# EAGLE design Xadow_SD (EAGLE 7.1.0)
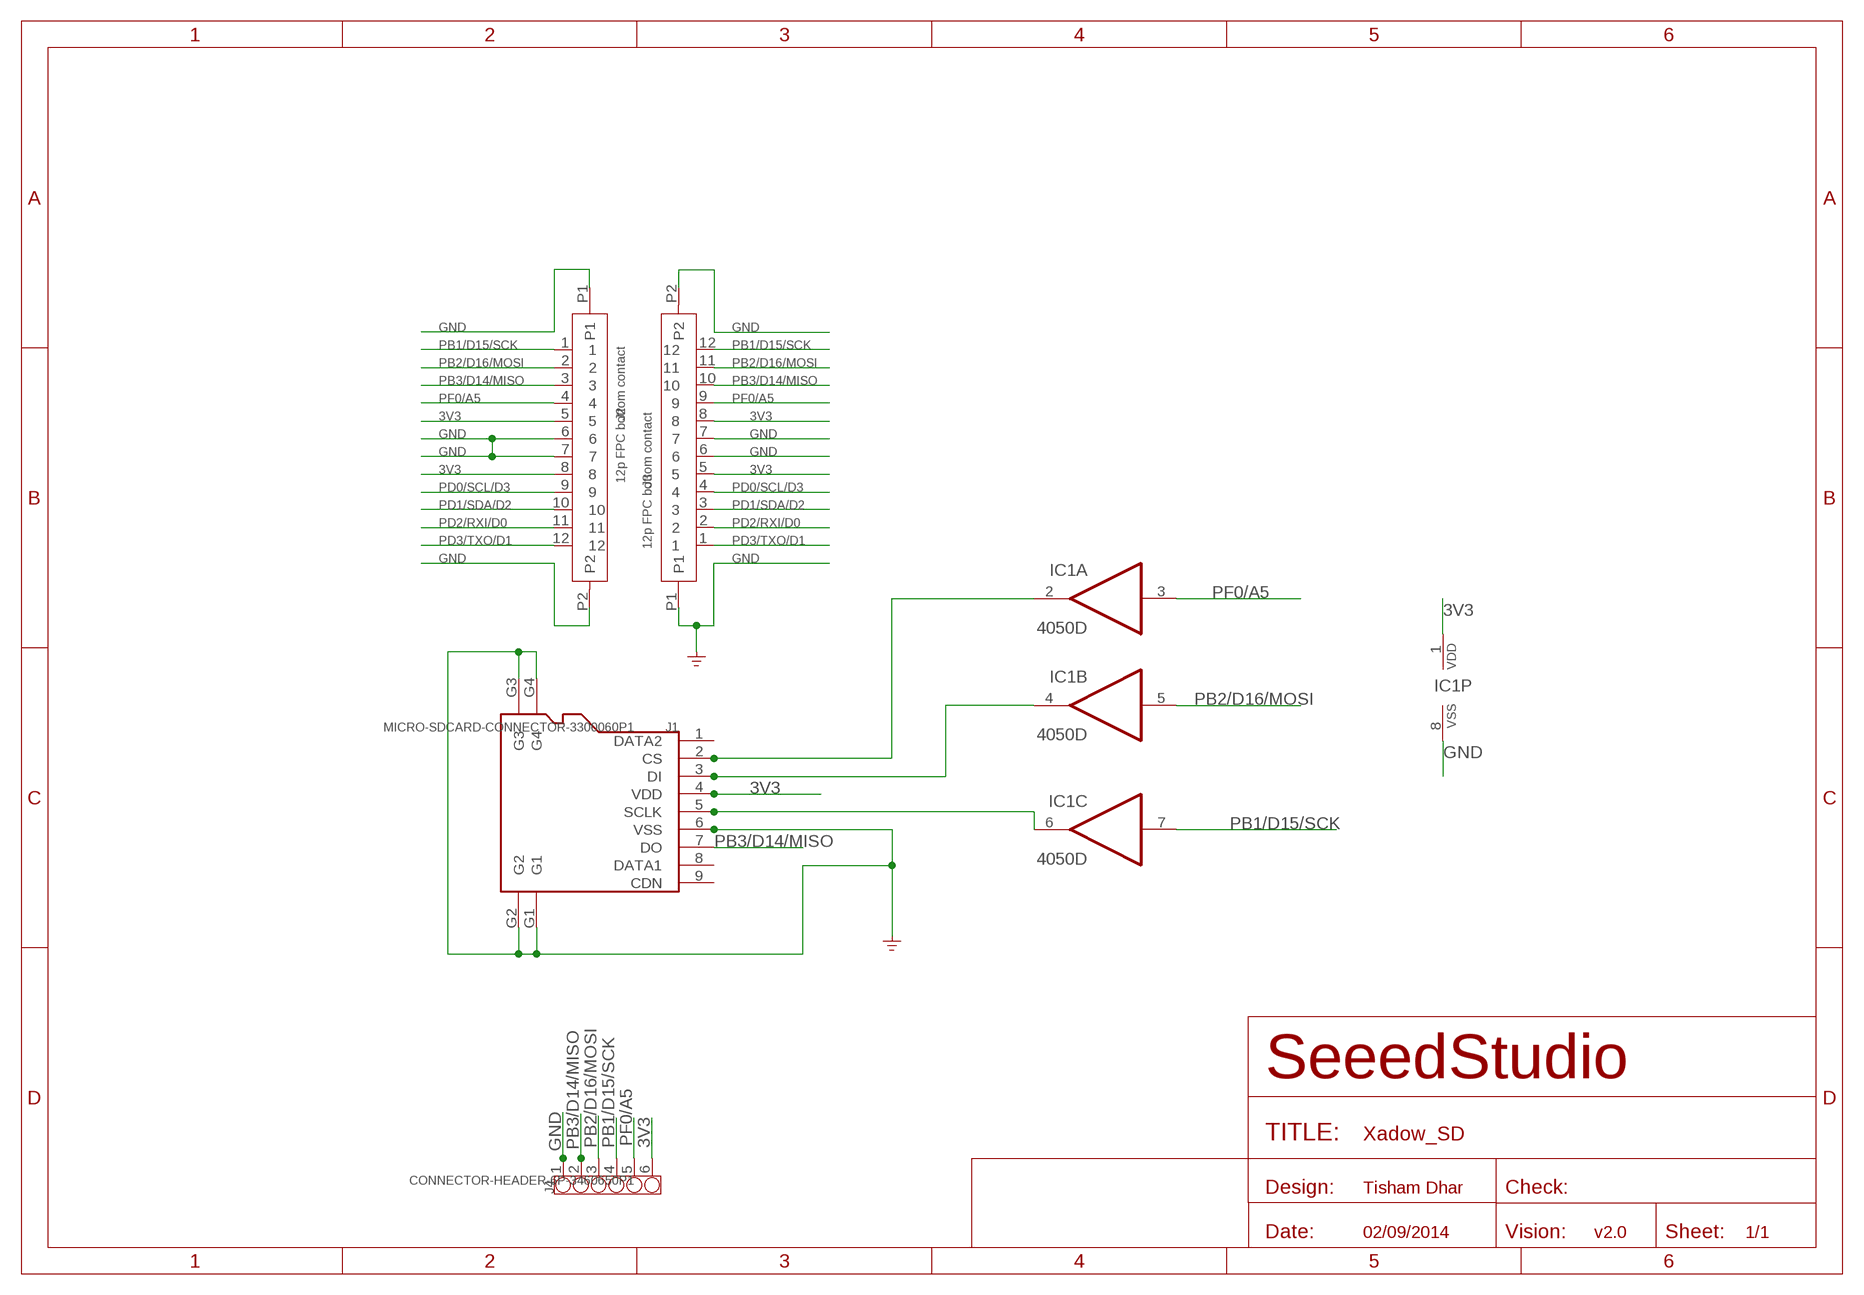
[diagram p0: schematic, sheet 1]

## Parts
IC1  4050D  [SO16]
J1  MICRO-SDCARD-CONNECTOR-3300060P1  [9P-SMD-W-RING]
J2  12p FPC bottom contact  FPC052002-12LT  [12P-0.5]
J3  12p FPC bottom contact  FPC052002-12LT  [12P-0.5]
J4  CONNECTOR-HEADER-6P-3460650P1  [1X6P-2.54-2.54-11.6-3.0-BLACK-MALE]

## Nets
3V3: IC1.1(P:VDD) J1.4(VDD) J2.5 J2.8 J3.5 J3.8 J4.6
CS: IC1.2(A:O) J1.2(CS)
GND: IC1.8(P:VSS) J1.6(VSS) J1.G1 J1.G2 J1.G3 J1.G4 J2.6 J2.7 J2.P1 J2.P2 J3.6 J3.7 J3.P1 J3.P2 J4.1
MOSI: IC1.4(B:O) J1.3(DI)
PB1/D15/SCK: IC1.7(C:I) J2.1 J3.12 J4.4
PB2/D16/MOSI: IC1.5(B:I) J2.2 J3.11 J4.3
PB3/D14/MISO: J1.7(DO) J2.3 J3.10 J4.2
PD0/SCL/D3: J2.9 J3.4
PD1/SDA/D2: J2.10 J3.3
PD2/RXI/D0: J2.11 J3.2
PD3/TXO/D1: J2.12 J3.1
PF0/A5: IC1.3(A:I) J2.4 J3.9 J4.5
SCK: IC1.6(C:O) J1.5(SCLK)
Unconnected: IC1.9(D:I) IC1.10(D:O) IC1.11(E:I) IC1.12(E:O) IC1.14(F:I) IC1.15(F:O) J1.1(DATA2) J1.8(DATA1) J1.9(CDN)

## Notes on the sheet
- Tisham Dhar
- 02/09/2014 | v2.0

## Library data of the parts
IC1 = 40xx:4050: Hex non-inverting BUFFER
J1 = OPL:MICRO-SDCARD-CONNECTOR: Micro SD Card
J2 J3 = template:FPC052002-12LT
J4 = OPL:CONNECTOR-HEADER-6P

## Net classes
0 default: width 0.152 mm, drill 0.305 mm, clearance 0.152 mm
1 GND: width 0.305 mm, drill 0.305 mm, clearance 0.152 mm to class 0, clearance 0.152 mm
3 usbvcc: width 0.203 mm, drill 0.305 mm, clearance 0.203 mm

## Board
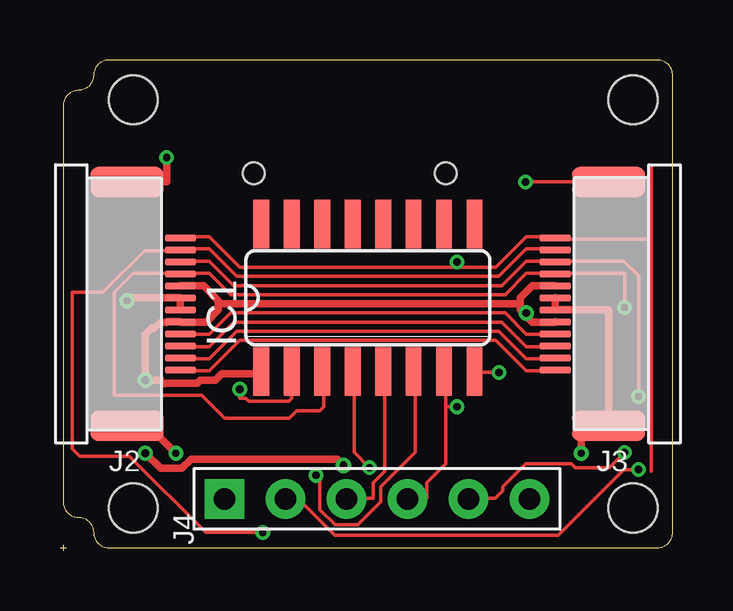
[diagram p1: board, top side]
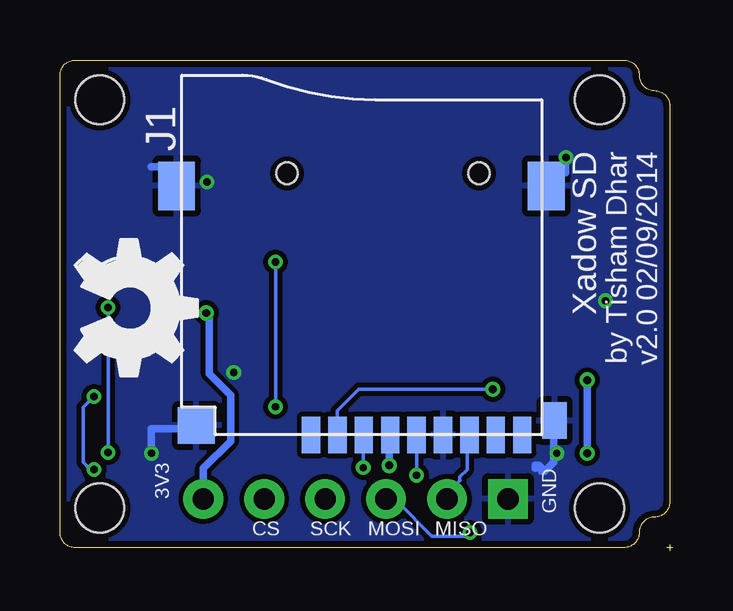
[diagram p2: board, bottom side, seen from below]

Size 25.53 x 20.45 mm. Coordinates in mm from the lower left corner, seen from the top.
Outline: 25.53,19.81 arc90 24.89,20.45
Outline: 2.03,20.45 arc90 1.4,19.81
Outline: 1.4,19.81 arc-90 0.76,19.18
Outline: 0.76,19.18 arc90 0.13,18.54
Outline: 0.13,2.03 arc90 0.76,1.4
Outline: 0.76,1.4 arc-90 1.4,0.76
Outline: 1.4,0.76 arc90 2.03,0.13
Outline: 24.89,0.13 arc90 25.53,0.76
Outline: 25.53,0.76 25.53,19.81
Outline: 25.53,19.81 arc90 24.89,20.45
Outline: 24.89,20.45 2.03,20.45
Outline: 2.03,20.45 arc90 1.4,19.81
Outline: 1.4,19.81 arc-90 0.76,19.18
Outline: 0.76,19.18 arc90 0.13,18.54
Outline: 0.13,18.54 0.13,2.03
Outline: 0.13,2.03 arc90 0.76,1.4
Outline: 0.76,1.4 arc-90 1.4,0.76
Outline: 1.4,0.76 1.4,0.76
Outline: 1.4,0.76 arc90 2.03,0.13
Outline: 2.03,0.13 24.89,0.13
Outline: 24.89,0.13 arc90 25.53,0.76
Outline: 0,0.13 0.25,0.13
Outline: 0.13,0.25 0.13,0
Copper layers (1*16): Top 0.035mm / dielectric 1.5mm / Bottom 0.035mm
Design rules "dirt_cheap_dirty_boards.v1": minimum track width 5mil, minimum drill 12mil, track to track 5mil, track to pad 5mil, pad to pad 5mil, via to via 5mil, smd to smd 0mil, copper to edge 10mil, drill to drill 10mil, minimum pad ring 10mil, minimum via ring 6mil, stop-mask expansion 2mil, vias tented up to drill 25mil, thermal gap 10mil
Holes 2.03 mm at 3.05,1.78 3.05,18.8 23.88,18.8 23.88,1.78
tRestrict: area 20.3,10 to 21,10.5; area 4.8,10 to 5.3,10.5

### Footprints (pad centres in the part's own frame; a part is rotated, then mirrored left to right if it is on the bottom)
SO16 = smd 0.66 x 2.032: 1 -4.445,-3.073; 2 -3.175,-3.073; 3 -1.905,-3.073; 4 -0.635,-3.073; 5 0.635,-3.073; 6 1.905,-3.073; 7 3.175,-3.073; 8 4.445,-3.073; 9 4.445,3.073; 10 3.175,3.073; 11 1.905,3.073; 12 0.635,3.073; 13 -0.635,3.073; 14 -1.905,3.073; 15 -3.175,3.073; 16 -4.445,3.073
9P-SMD-W-RING = smd 1.524 x 0.762: 1 -7.493,2.114; 2 -7.493,1.014; 3 -7.493,-0.086; 4 -7.493,-1.186; 5 -7.493,-2.286; 6 -7.493,-3.386; 7 -7.493,-4.486; 8 -7.493,-5.586; 9 -7.493,-6.686 | smd 1.524 x 1.016: G1 -6.893,-8.032 | smd 2.032 x 1.524: G2 2.88,-7.686; G3 2.88,7.714 | smd 1.524 x 1.524: G4 -7.101,6.895 | hole 0.889: 3.407,-4.886; 3.407,3.114
12P-0.5 = smd 0.3 x 1.3: 1 -2.75,2.35; 2 -2.25,2.35; 3 -1.75,2.35; 4 -1.25,2.35; 5 -0.75,2.35; 6 -0.25,2.35; 7 0.25,2.35; 8 0.75,2.35; 9 1.25,2.35; 10 1.75,2.35; 11 2.25,2.35; 12 2.75,2.35 | smd 1.27 x 3.048: P1 -5.08,0.127; P2 5.08,0.127
1X6P-2.54-2.54-11.6-3.0-BLACK-MALE = drill 0.889 pad 1.651 square: 1 0,6.35 | drill 0.889 pad 1.651: 2 0,3.81; 3 0,1.27; 4 0,-1.27; 5 0,-3.81; 6 0,-6.35

### Placement (x,y rotation side)
IC1  12.83,10.54 0 top
J1  12.95,12.32 90 bottom
J2  2.67,10.29 270 top
J3  22.99,10.29 90 top
J4  13.21,2.16 90 top
U$3  [OSHW_FILLX200_NOTEXT]  24.89,12.95 270 bottom

### Tracks (layer width: path | path; a pad name or v marks a point on that pad's centre or on a via)
3V3  (via drill 0.33)
  Top 0.203: 19.18,10.31 19.15,10.31 19.05,10.29 | 4.37,6.96 4.2,7.13 | 4.9,9.55 J2.8
  Top 0.305: J2.5 5.98,11.04 6.6,10.41 6.6,10.29 | J3.8 19.67,11.04 19.18,10.54 19.18,10.31 19.18,10.03 19.37,9.84 | 19.37,9.84 19.68,9.52 20.62,9.52 J3.5 | 6.6,10.29 6.6,10.03 6.1,9.52 5.03,9.52 J2.8 4.45,9.52 4.19,9.52 3.94,9.27 3.81,9.27 3.56,9.02 v3.56,7.11 4.19,7.11 4.2,7.13 | 6.6,10.29 19.05,10.29 | 4.37,6.96 4.45,6.99 5.71,6.99 5.84,7.11 6.48,7.11 6.73,7.37 8.38,7.37 IC1.1 | v11.81,3.56 11.56,3.81 5.46,3.81 5.08,3.43 4.19,3.43 v3.56,4.06 | 4.9,9.55 4.47,9.55 | v19.43,9.91 19.37,9.84
  Bottom 0.152: 11.46,5.51 11.76,5.51 J1.4
  Bottom 0.305: 11.76,5.44 11.76,4.83 J1.4 11.81,4.7 v11.81,3.56 | v3.56,7.11 v3.56,4.06 | v19.43,9.91 19.3,9.91 19.3,7.37 18.41,6.48 18.41,4.57 19.56,3.43 J4.6
CS  (via drill 0.33)
  Top 0.152: v7.49,6.73 7.49,6.35 7.75,6.35 7.87,6.22 9.52,6.22 9.65,6.35 IC1.2
  Bottom 0.152: v7.49,6.73 13.08,6.73 13.97,5.84 J1.2
GND  (via drill 0.3)
  Top 0.152: v18.29,7.43 17.34,7.43 IC1.8 | v19.4,15.37 J3.P2
  Top 0.305: J2.7 J2.6 2.79,10.54 v2.79,10.41 | J3.7 J3.6 22.86,10.04 J3.P1 21.72,5.21 v21.72,4.06 | v4.83,4.06 3.68,5.21 J2.P2 | v4.45,16.38 4.45,15.37 J2.P1 | J3.P2 21.72,15.37
  Bottom 0.152: J1.G4 19.72,4.89 19.75,4.89 | J1.6 9.63,4.83 9.63,4.74
  Bottom 0.305: 4.45,15.75 v4.45,16.38 | 21.72,16 20.57,16 20.57,15.49 | 20.32,5.08 21.72,5.08 v21.72,4.06 | J1.G1 4.95,5.33 4.95,3.68 5.33,3.3 5.46,3.3 5.46,3.43 5.59,3.56 5.71,3.56 5.71,3.43
  pour Bottom (isolate 0.203): 0.13,0.13 25.53,0.13 25.53,20.45 0.13,20.45
MOSI  (via drill 0.3)
  Top 0.152: v12.89,3.46 12.26,4.1 12.26,7.43 IC1.4
  Bottom 0.152: v12.89,3.46 12.89,4.73 J1.3
PB1/D15/SCK  (via drill 0.3)
  Top 0.152: 16.54,11.81 7.49,11.81 6.22,13.08 5.08,13.08 J2.1 | 16.54,11.81 18.16,11.81 19.43,13.08 20.57,13.08 J3.12 20.67,12.99 24.64,12.99 | 24.64,3.3 24.64,12.99 | 24.64,12.99 24.64,16 | 16.07,6 16.07,3.62 15.27,2.83 15.27,2.19 14.48,2.19 J4.4 | 16.07,6 16.07,7.43 IC1.7 | v16.54,12.03 16.54,11.81 | 16.07,6 v16.54,6
  Bottom 0.152: v16.54,6 v16.54,12.03
PB2/D16/MOSI  (via drill 0.3)
  Top 0.152: J3.11 20.57,12.57 19.43,12.57 18.29,11.43 7.37,11.43 6.22,12.57 5.08,12.57 J2.2 4.95,12.51 3.52,12.51 1.78,10.76 0.51,10.76 0.51,4.25 0.82,3.94 2.89,3.94 6.06,0.76 v8.45,0.76 | IC1.5 13.53,7.43 13.53,3.3 13.05,2.83 13.05,2.19 11.94,2.19 J4.3
  Bottom 0.152: v8.45,0.76 8.6,0.6 10.03,0.6 11.46,2.03 11.94,2.03 J4.3
PB3/D14/MISO  (via drill 0.3)
  Top 0.152: J2.3 5.08,12.07 6.22,12.07 7.24,11.05 18.41,11.05 19.43,12.07 20.57,12.07 J3.10 | 20.7,12.07 J3.10 | J4.2 9.93,2.16 11.46,0.63 20.75,0.63 23.5,3.38 v24.11,3.38 | v24.11,6.43 24.11,11.46 23.5,12.07 20.75,12.07 J3.10
  Bottom 0.152: J1.7 8.56,4.75 8.56,3.38 8.86,3.07 8.86,2.92 9.32,2.46 9.32,2.16 J4.2 | v24.11,3.38 24.26,3.38 24.56,3.68 24.56,5.97 v24.11,6.43
PD0/SCL/D3
  Top 0.152: J2.9 5.08,9.02 6.22,9.02 7.11,9.91 18.54,9.91 19.43,9.02 20.57,9.02 J3.4
PD1/SDA/D2
  Top 0.152: J2.10 5.08,8.51 6.22,8.51 7.24,9.52 18.41,9.52 19.43,8.51 20.57,8.51 J3.3
PD2/RXI/D0
  Top 0.152: J2.11 5.08,8 6.22,8 7.37,9.14 18.29,9.14 19.43,8 20.57,8 J3.2
PD3/TXO/D1
  Top 0.152: J2.12 5.08,7.49 6.22,7.49 7.49,8.76 18.16,8.76 19.43,7.49 20.57,7.49 J3.1
PF0/A5  (via drill 0.3)
  Top 0.152: IC1.3 10.99,7.43 10.99,6 10.83,5.84 9.87,5.84 9.56,5.52 6.86,5.52 5.9,6.48 2.25,6.48 2.25,10.76 3.05,11.56 4.95,11.56 J2.4 5.08,11.56 6.22,11.56 7.11,10.67 18.54,10.67 19.43,11.56 20.57,11.56 J3.9 20.83,11.56 23.53,11.56 v23.53,10.13 | v23.53,4.1 22.89,3.46 21.46,3.46 21.3,3.62 19.4,3.62 18.45,2.67 18.45,2.51 18.13,2.19 17.02,2.19 J4.5
  Bottom 0.152: v23.53,10.13 v23.53,4.1
SCK  (via drill 0.3)
  Top 0.152: v10.67,3.14 10.83,2.98 10.83,1.71 11.46,1.08 12.41,1.08 13.37,2.03 13.37,2.67 14.8,4.1 14.8,7.43 IC1.6
  Bottom 0.152: v10.67,3.14 J1.5

### Text on the board
bPlace: v2.0 02/09/2014 | by Tisham Dhar | Xadow SD | GND | 3V3 | MISO | MOSI | SCK | CS